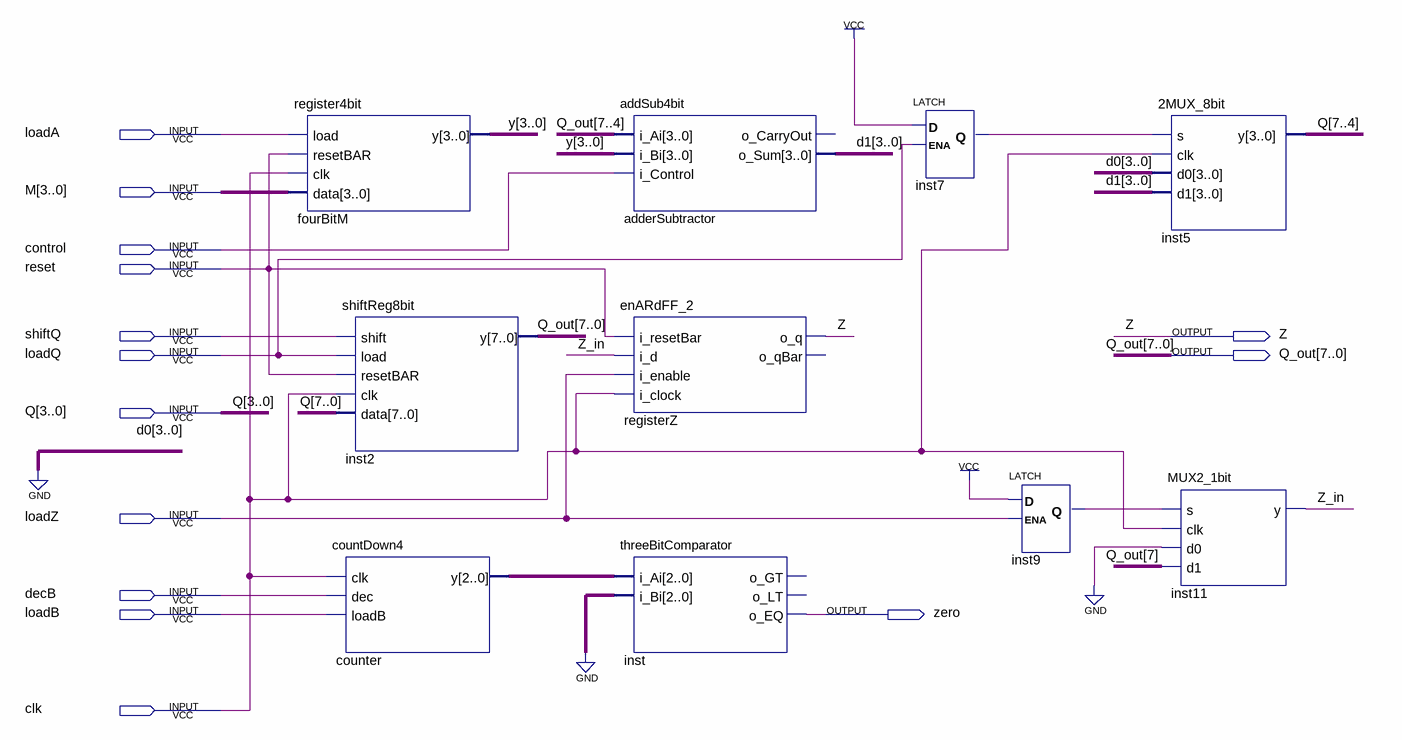
[diagram p0: schematic sheet]
// Quartus schematic Multiplier.bdf as structural Verilog: 10 symbols, 14 pins
module Multiplier (
  input  loadA,
  input  [3:0] M,
  input  control,
  input  reset,
  input  shiftQ,
  input  loadQ,
  input  [7:0] Q,
  input  loadZ,
  input  decB,
  input  loadB,
  input  clk,
  output Z,
  output [7:0] Q_out,
  output zero
);

  wire inst7_q, inst9_q, Z_in;
  wire [2:0] counter_y;
  wire [3:0] d1, y;

  register4bit fourBitM (.load(loadA), .resetBAR(reset), .clk(clk), .data(M), .y(y));
  shiftReg8bit inst2 (.shift(shiftQ), .load(loadQ), .resetBAR(reset), .clk(clk), .data(Q), .y(Q_out));
  countDown4 counter (.clk(clk), .dec(decB), .loadB(loadB), .y(counter_y));
  addSub4bit adderSubtractor (.i_Ai(Q_out[7:4]), .i_Bi(y), .i_Control(control), .o_Sum(d1));  // open: o_CarryOut
  enARdFF_2 registerZ (.i_resetBar(reset), .i_d(Z_in), .i_enable(loadZ), .i_clock(clk), .o_q(Z));  // open: o_qBar
  threeBitComparator inst (.i_Ai(counter_y), .i_Bi(3'b000), .o_EQ(zero));  // open: o_GT, o_LT
  LATCH inst7 (.D(1'b1), .ENA(loadQ), .Q(inst7_q));
  LATCH inst9 (.D(1'b1), .ENA(loadZ), .Q(inst9_q));
  \2MUX_8bit  inst5 (.s(inst7_q), .clk(clk), .d0(4'b0000), .d1(d1), .y(Q[7:4]));
  MUX2_1bit inst11 (.s(inst9_q), .clk(clk), .d0(1'b0), .d1(Q_out[7]), .y(Z_in));
endmodule
